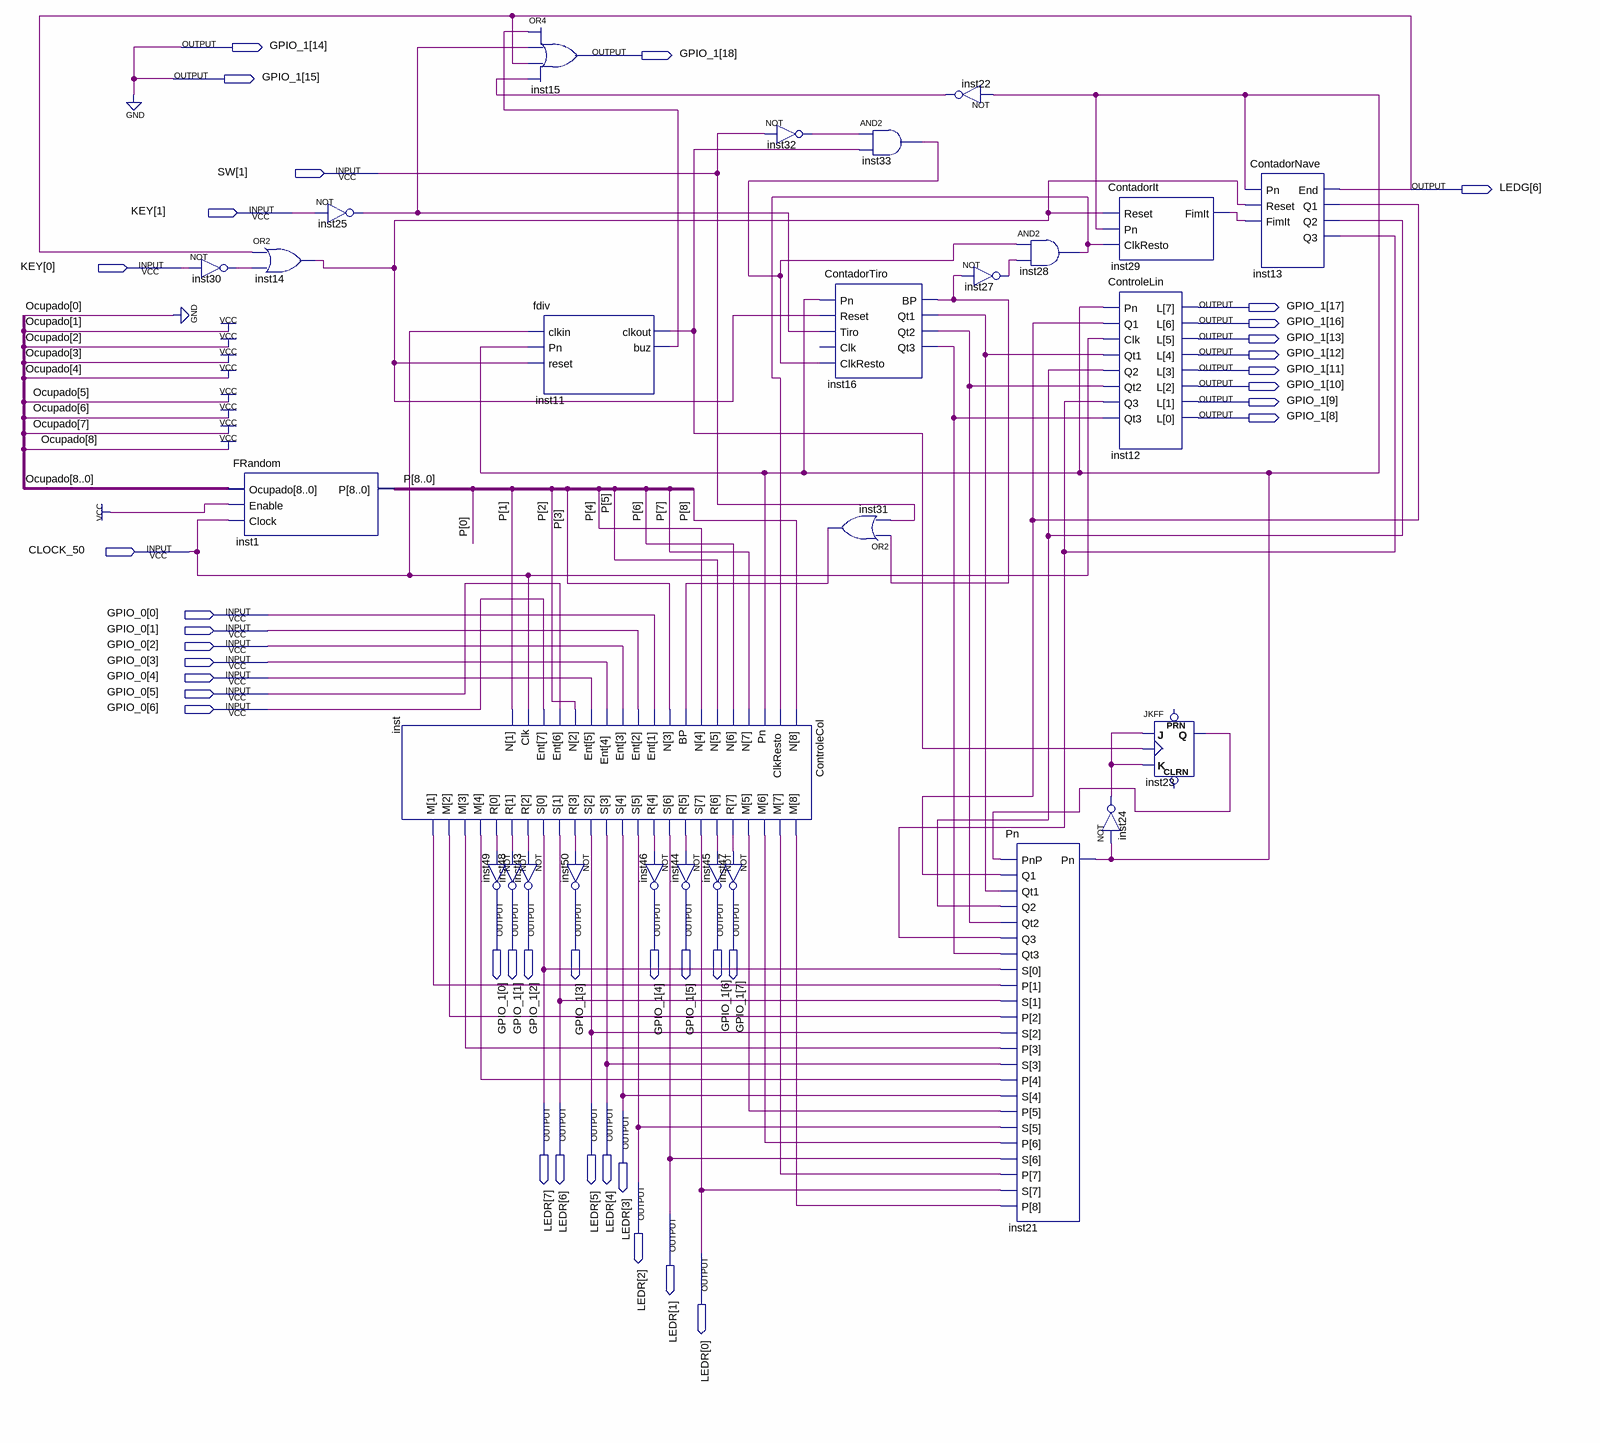
[diagram p0: schematic sheet]
// Quartus schematic Projeto.bdf as structural Verilog: 28 symbols, 39 pins
module Projeto (
  input  [1:1] SW,
  input  [1:0] KEY,
  input  CLOCK_50,
  input  [6:0] GPIO_0,
  output [18:0] GPIO_1,
  output [6:6] LEDG,
  output [7:0] LEDR
);

  wire inst11_buz, inst11_clkout, inst13_q1, inst13_q2, inst13_q3, inst14_out, inst16_bp, inst16_qt1,
       inst16_qt2, inst16_qt3, inst21_pn, inst22_out, inst23_q, inst24_out, inst25_out, inst27_out,
       inst28_out, inst29_fimit, inst30_out, inst31_out, inst32_out, inst33_out, inst_m, inst_m_2, inst_m_3,
       inst_m_4, inst_m_5, inst_m_6, inst_m_7, inst_m_8, inst_r, inst_r_2, inst_r_3, inst_r_4, inst_r_5,
       inst_r_6, inst_r_7, inst_r_8;
  wire [8:0] P;

  not inst30 (inst30_out, KEY[0]);
  FRandom inst1 (.Ocupado(9'b111111110), .Enable(1'b1), .Clock(CLOCK_50), .P(P));
  or inst14 (inst14_out, LEDG[6], inst30_out);
  not inst25 (inst25_out, KEY[1]);
  ControleCol inst (
    .N(P[8:1]), .ClkResto(inst28_out), .Pn(inst21_pn), .BP(inst31_out), .Ent(GPIO_0), .Clk(CLOCK_50),
    .M({inst_m, inst_m_2, inst_m_3, inst_m_4, inst_m_8, inst_m_7, inst_m_6, inst_m_5}),
    .R({inst_r_4, inst_r_5, inst_r_6, inst_r_7, inst_r_8, inst_r_3, inst_r_2, inst_r}),
    .S({LEDR[0], LEDR[1], LEDR[2], LEDR[3], LEDR[4], LEDR[5], LEDR[6], LEDR[7]}));
  not inst49 (GPIO_1[0], inst_r);
  or inst15 (GPIO_1[18], inst11_buz, inst25_out, LEDG[6], inst22_out);
  fdiv inst11 (.clkin(CLOCK_50), .Pn(inst21_pn), .reset(inst14_out), .clkout(inst11_clkout), .buz(inst11_buz));
  not inst43 (GPIO_1[2], inst_r_3);
  not inst48 (GPIO_1[1], inst_r_2);
  not inst50 (GPIO_1[3], inst_r_8);
  not inst44 (GPIO_1[5], inst_r_6);
  not inst46 (GPIO_1[4], inst_r_7);
  not inst45 (GPIO_1[6], inst_r_5);
  not inst47 (GPIO_1[7], inst_r_4);
  not inst32 (inst32_out, SW[1]);
  and inst33 (inst33_out, inst32_out, inst11_clkout);
  ContadorTiro inst16 (
    .Pn(inst21_pn), .Reset(inst14_out), .Tiro(inst25_out), .ClkResto(inst33_out), .BP(inst16_bp),
    .Qt1(inst16_qt1), .Qt2(inst16_qt2), .Qt3(inst16_qt3));  // open: Clk
  or inst31 (inst31_out, inst16_bp, SW[1]);
  not inst22 (inst22_out, inst21_pn);
  not inst27 (inst27_out, inst16_bp);
  and inst28 (inst28_out, inst33_out, inst27_out);
  Pn inst21 (
    .PnP(inst23_q), .Q1(inst13_q1), .Qt1(inst16_qt1), .Q2(inst13_q2), .Qt2(inst16_qt2), .Q3(inst13_q3),
    .Qt3(inst16_qt3), .S({LEDR[0], LEDR[1], LEDR[2], LEDR[3], LEDR[4], LEDR[5], LEDR[6], LEDR[7]}),
    .P({inst_m, inst_m_2, inst_m_3, inst_m_4, inst_m_8, inst_m_7, inst_m_6, inst_m_5}), .Pn(inst21_pn));
  ContadorIt inst29 (.Reset(inst14_out), .Pn(inst21_pn), .ClkResto(inst28_out), .FimIt(inst29_fimit));
  ControleLin inst12 (
    .Pn(inst21_pn), .Q1(inst13_q1), .Clk(CLOCK_50), .Qt1(inst16_qt1), .Q2(inst13_q2), .Qt2(inst16_qt2),
    .Q3(inst13_q3), .Qt3(inst16_qt3), .L({GPIO_1[17:16], GPIO_1[13:8]}));
  not inst24 (inst24_out, inst21_pn);
  JKFF inst23 (.K(inst24_out), .J(inst24_out), .CLK(inst11_clkout), .Q(inst23_q));  // open: PRN, CLRN
  ContadorNave inst13 (
    .Pn(inst21_pn), .Reset(inst14_out), .FimIt(inst29_fimit), .End(LEDG[6]), .Q1(inst13_q1), .Q2(inst13_q2),
    .Q3(inst13_q3));

  assign GPIO_1[15:14] = 2'b00;
endmodule
